# Altium schematic sheet USB Type C.SchDoc: USB Type C
size Tabloid; ApprovedBy: NA; CompanyName: Cospan Design LLC; DrawnBy: Dave McCoy; Engineer: Dave McCoy; DocumentNumber: 10; Revision: A; SheetNumber: 10; SheetTotal: 20; Client: Public; Project: Enigma; ProjectPrettyName: Enigma
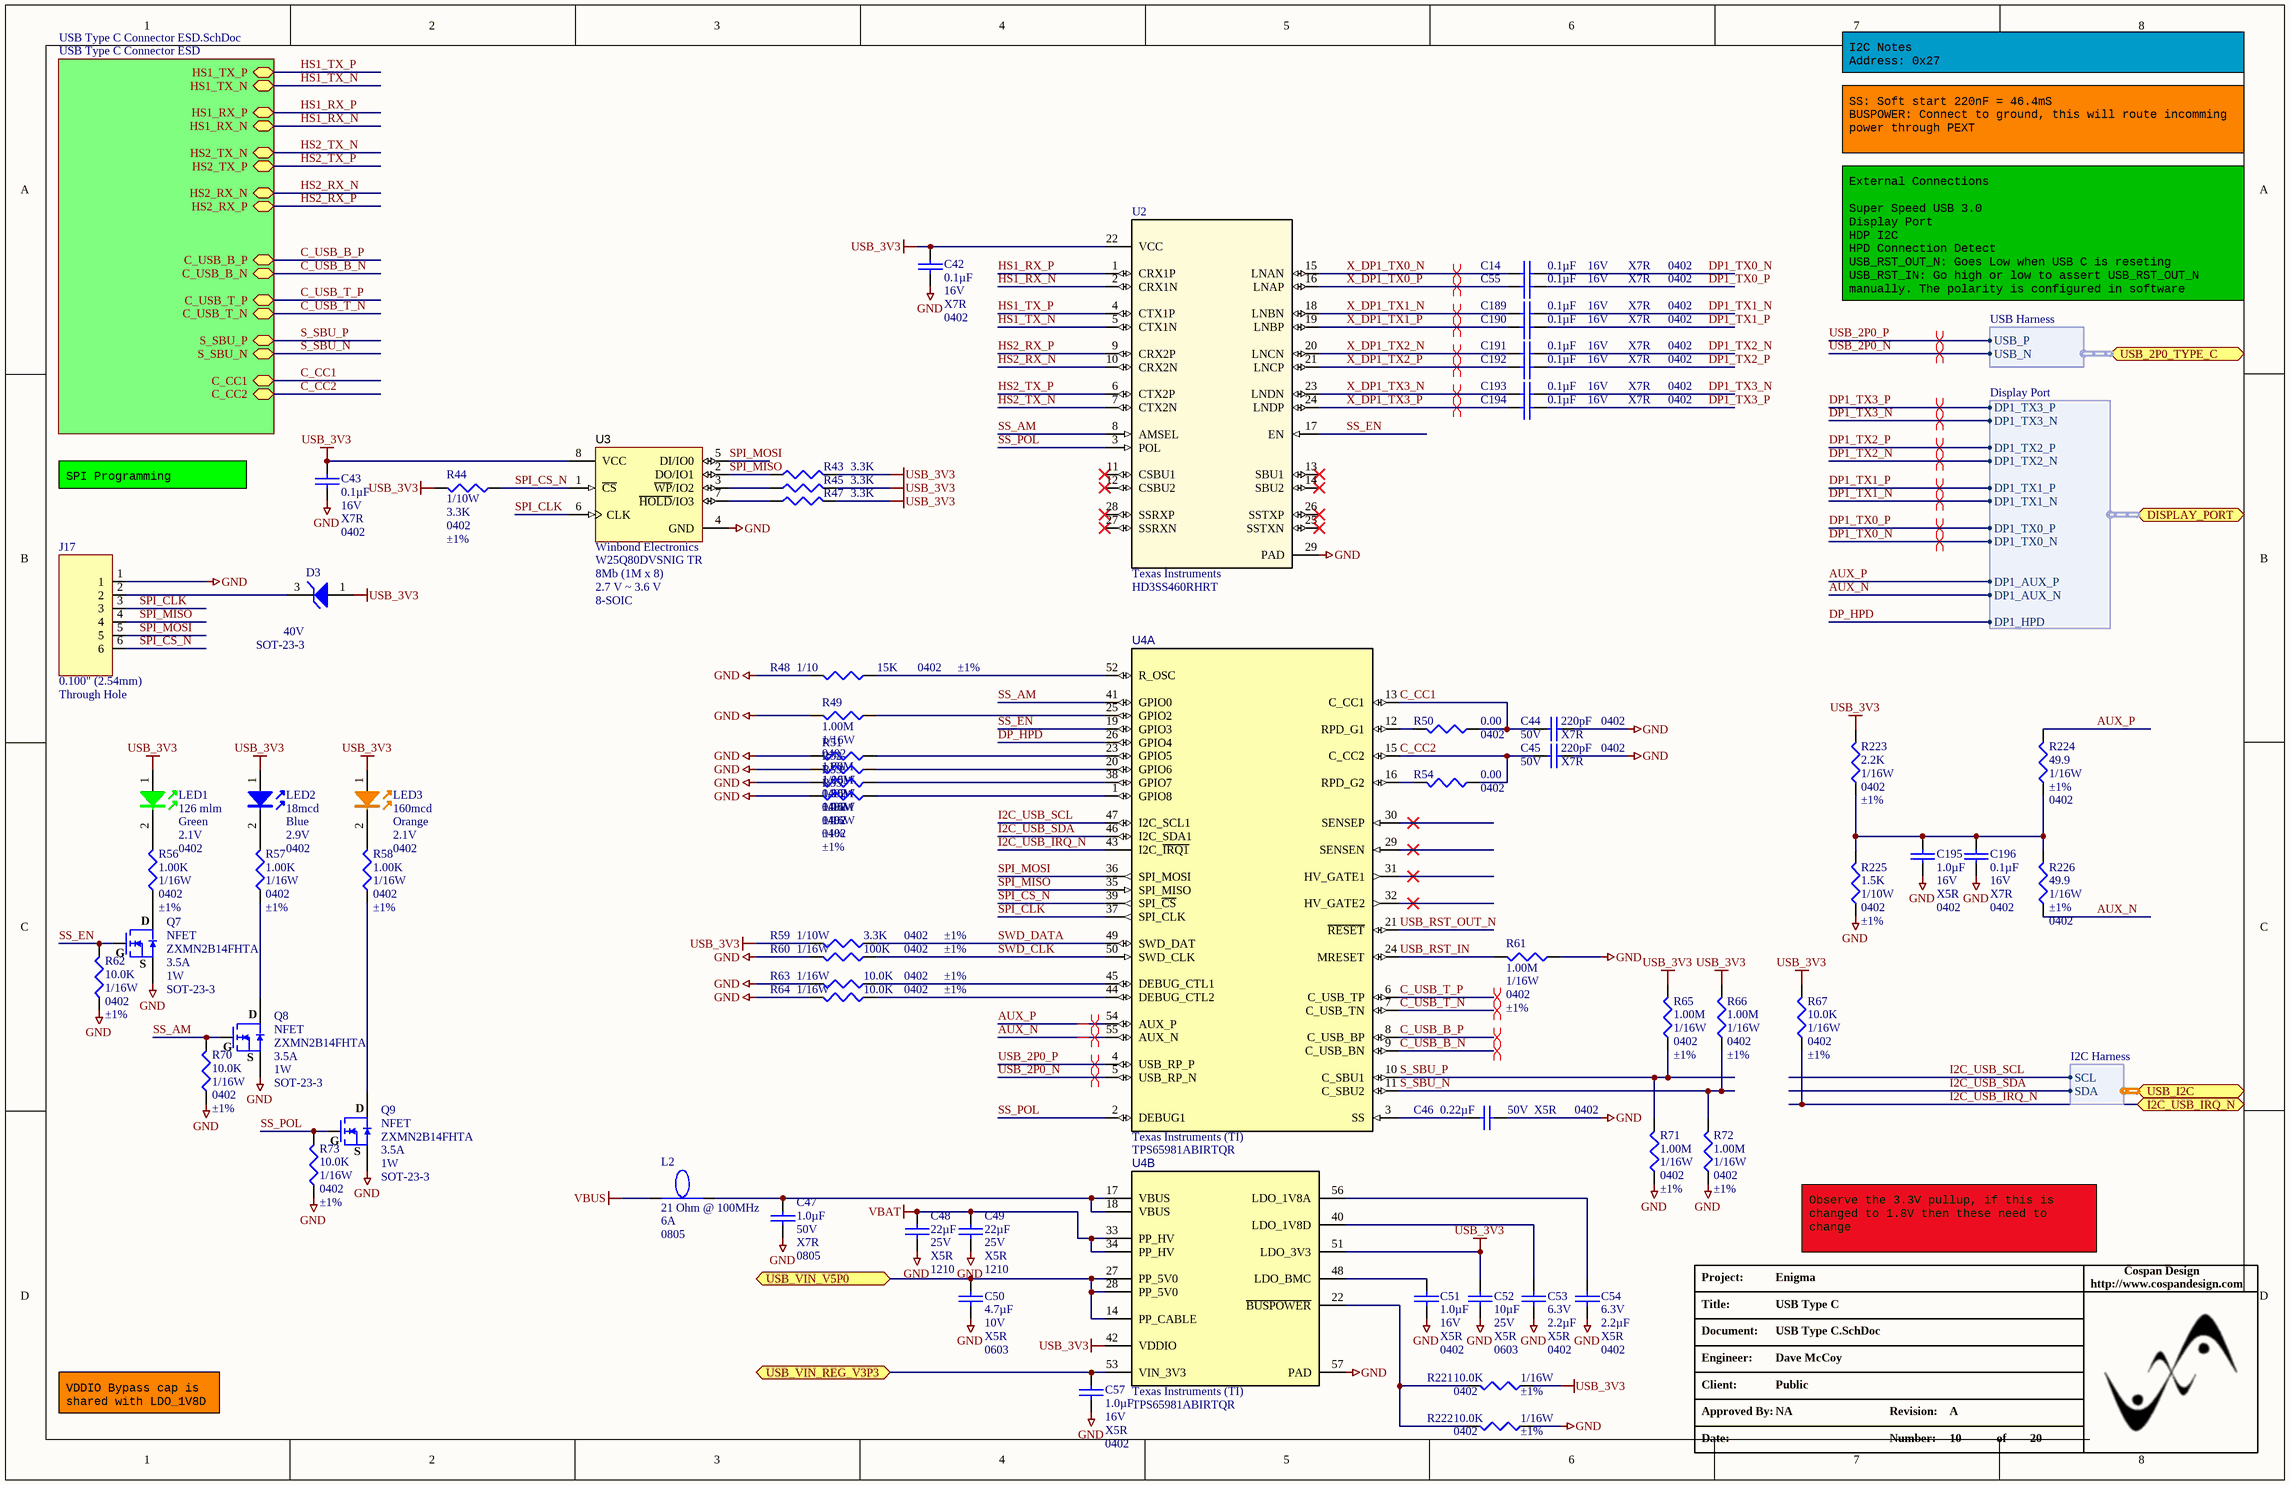
[diagram p0: USB Type C.SchDoc]

## Parts
C14  Capacitance: 0.1µF  Voltage - Rated: 16V  Temperature Coefficient: X7R  Package / Case: 0402  [C_0402]  (hidden comment: 0.1uF)
C42  Capacitance: 0.1µF  Voltage - Rated: 16V  Temperature Coefficient: X7R  Package / Case: 0402  [C_0402]  (hidden comment: 0.1uF)
C43  Capacitance: 0.1µF  Voltage - Rated: 16V  Temperature Coefficient: X7R  Package / Case: 0402  [C_0402]  (hidden comment: 0.1uF)
C44  Voltage - Rated: 50V  Temperature Coefficient: X7R  Package / Case: 0402  [C_0402]  (hidden comment: 220pF)
C45  Voltage - Rated: 50V  Temperature Coefficient: X7R  Package / Case: 0402  [C_0402]  (hidden comment: 220pF)
C46  Capacitance: 0.22µF  Voltage - Rated: 50V  Temperature Coefficient: X5R  Package / Case: 0402  [C_0402]  (hidden comment: C_0402_0.22UF_50V)
C47  Capacitance: 1.0µF  Voltage - Rated: 50V  Temperature Coefficient: X7R  Package / Case: 0805  [C_ERA-0805]  (hidden comment: 1.0uF)
C48  Voltage - Rated: 25V  Temperature Coefficient: X5R  Package / Case: 1210  [C_14-1210]  (hidden comment: 22µF)
C49  Voltage - Rated: 25V  Temperature Coefficient: X5R  Package / Case: 1210  [C_14-1210]  (hidden comment: 22µF)
C50  Voltage - Rated: 10V  Temperature Coefficient: X5R  Package / Case: 0603  [C_ERA-0603]  (hidden comment: 4.7µF)
C51  Capacitance: 1.0µF  Voltage - Rated: 16V  Temperature Coefficient: X5R  Package / Case: 0402  [C_ERA-0402]  (hidden comment: 1.0uF)
C52  Capacitance: 10µF  Voltage - Rated: 25V  Temperature Coefficient: X5R  Package / Case: 0603  [C_ERA-0603]  (hidden comment: C_0603_10µF)
C53  Voltage - Rated: 6.3V  Capacitance: 2.2µF  Temperature Coefficient: X5R  Package / Case: 0402  [C_0402]  (hidden comment: 2.2uF)
C54  Voltage - Rated: 6.3V  Capacitance: 2.2µF  Temperature Coefficient: X5R  Package / Case: 0402  [C_0402]  (hidden comment: 2.2uF)
C55  Capacitance: 0.1µF  Voltage - Rated: 16V  Temperature Coefficient: X7R  Package / Case: 0402  [C_0402]  (hidden comment: 0.1uF)
C57  Capacitance: 1.0µF  Voltage - Rated: 16V  Temperature Coefficient: X5R  Package / Case: 0402  [C_ERA-0402]  (hidden comment: 1.0uF)
C189  Capacitance: 0.1µF  Voltage - Rated: 16V  Temperature Coefficient: X7R  Package / Case: 0402  [C_0402]  (hidden comment: 0.1uF)
C190  Capacitance: 0.1µF  Voltage - Rated: 16V  Temperature Coefficient: X7R  Package / Case: 0402  [C_0402]  (hidden comment: 0.1uF)
C191  Capacitance: 0.1µF  Voltage - Rated: 16V  Temperature Coefficient: X7R  Package / Case: 0402  [C_0402]  (hidden comment: 0.1uF)
C192  Capacitance: 0.1µF  Voltage - Rated: 16V  Temperature Coefficient: X7R  Package / Case: 0402  [C_0402]  (hidden comment: 0.1uF)
C193  Capacitance: 0.1µF  Voltage - Rated: 16V  Temperature Coefficient: X7R  Package / Case: 0402  [C_0402]  (hidden comment: 0.1uF)
C194  Capacitance: 0.1µF  Voltage - Rated: 16V  Temperature Coefficient: X7R  Package / Case: 0402  [C_0402]  (hidden comment: 0.1uF)
C195  Capacitance: 1.0µF  Voltage - Rated: 16V  Temperature Coefficient: X5R  Package / Case: 0402  [C_ERA-0402]  (hidden comment: 1.0uF)
C196  Capacitance: 0.1µF  Voltage - Rated: 16V  Temperature Coefficient: X7R  Package / Case: 0402  [C_0402]  (hidden comment: 0.1uF)
D3  Voltage - Zener (Nom) (Vz): 40V  Supplier Device Package: SOT-23-3  [SOT23]  (hidden comment: BZX84C16-7-F)
J17  Pitch: 0.100" (2.54mm)  Mounting Type: Through Hole  [HDR_1X6]  (hidden comment: J_HDR1X6_THRHOLE_VERT)
L2  Impedance @ Frequency: 21 Ohm @ 100MHz  Current Rating: 6A  Package / Case: 0805  [C_ERA-0805]  (hidden comment: L_FB_21OHM_100MHZ)
LED1  Luminous Flux @ Current - Test: 126 mlm  Color: Green  Voltage - Forward (Vf) Typ: 2.1V  Package / Case: 0402  [DIOM1005X07L_GREEN]  (hidden comment: LED_GRN_0402)
LED2  Luminous Flux @ Current - Test: 18mcd  Color: Blue  Voltage - Forward (Vf) Typ: 2.9V  Package / Case: 0402  [DIOM1005X07L_BLUE]  (hidden comment: LED_BLUE_0402)
LED3  Millicandela Rating: 160mcd  Color: Orange  Voltage - Forward (Vf) Typ: 2.1V  Package / Case: 0402  [DIOM1005X07L_ORANGE]  (hidden comment: LED_ORN_0402)
Q7  NFET  Manufacturer Part Number: ZXMN2B14FHTA  Current - Continuous Drain (Id) @ 25° C: 3.5A  Power - Max: 1W  Package / Case: SOT-23-3  [SOT-23A]
Q8  NFET  Manufacturer Part Number: ZXMN2B14FHTA  Current - Continuous Drain (Id) @ 25° C: 3.5A  Power - Max: 1W  Package / Case: SOT-23-3  [SOT-23A]
Q9  NFET  Manufacturer Part Number: ZXMN2B14FHTA  Current - Continuous Drain (Id) @ 25° C: 3.5A  Power - Max: 1W  Package / Case: SOT-23-3  [SOT-23A]
R43  Resistance In Ohms: 3.3K  [R_0402]  (hidden comment: 3.3k Ohms)
R44  Power (Watts): 1/10W  Resistance In Ohms: 3.3K  Case: 0402  Tolerance: ±1%  [R_0402]  (hidden comment: 3.3k Ohms)
R45  Resistance In Ohms: 3.3K  [R_0402]  (hidden comment: 3.3k Ohms)
R47  Resistance In Ohms: 3.3K  [R_0402]  (hidden comment: 3.3k Ohms)
R48  Resistance In Ohms: 15K  Power (Watts): 1/10  Case: 0402  Tolerance: ±1%  [R_0402]  (hidden comment: R_0402_15.0K)
R49  Resistance In Ohms: 1.00M  Power (Watts): 1/16W  Case: 0402  Tolerance: ±1%  [R_0402]  (hidden comment: 1.0M Ohms)
R50  Resistance In Ohms: 0.00  Case: 0402  [R_0402]  (hidden comment: 0.0 Ohms)
R51  Resistance In Ohms: 1.00M  Power (Watts): 1/16W  Case: 0402  Tolerance: ±1%  [R_0402]  (hidden comment: 1.0M Ohms)
R52  Resistance In Ohms: 1.00M  Power (Watts): 1/16W  Case: 0402  Tolerance: ±1%  [R_0402]  (hidden comment: 1.0M Ohms)
R53  Resistance In Ohms: 1.00M  Power (Watts): 1/16W  Case: 0402  Tolerance: ±1%  [R_0402]  (hidden comment: 1.0M Ohms)
R54  Resistance In Ohms: 0.00  Case: 0402  [R_0402]  (hidden comment: 0.0 Ohms)
R55  Resistance In Ohms: 1.00M  Power (Watts): 1/16W  Case: 0402  Tolerance: ±1%  [R_0402]  (hidden comment: 1.0M Ohms)
R56  Resistance In Ohms: 1.00K  Power (Watts): 1/16W  Case: 0402  Tolerance: ±1%  [R_0402]  (hidden comment: 1.0k Ohms)
R57  Resistance In Ohms: 1.00K  Power (Watts): 1/16W  Case: 0402  Tolerance: ±1%  [R_0402]  (hidden comment: 1.0k Ohms)
R58  Resistance In Ohms: 1.00K  Power (Watts): 1/16W  Case: 0402  Tolerance: ±1%  [R_0402]  (hidden comment: 1.0k Ohms)
R59  Power (Watts): 1/10W  Resistance In Ohms: 3.3K  Case: 0402  Tolerance: ±1%  [R_0402]  (hidden comment: 3.3k Ohms)
R60  Resistance In Ohms: 100K  Power (Watts): 1/16W  Case: 0402  Tolerance: ±1%  [R_0402]  (hidden comment: R_0402_100K)
R61  Resistance In Ohms: 1.00M  Power (Watts): 1/16W  Case: 0402  Tolerance: ±1%  [R_0402]  (hidden comment: 1.0M Ohms)
R62  Resistance In Ohms: 10.0K  Power (Watts): 1/16W  Case: 0402  Tolerance: ±1%  [R_0402]  (hidden comment: R_0402_10.0K)
R63  Resistance In Ohms: 10.0K  Power (Watts): 1/16W  Case: 0402  Tolerance: ±1%  [R_0402]  (hidden comment: R_0402_10.0K)
R64  Resistance In Ohms: 10.0K  Power (Watts): 1/16W  Case: 0402  Tolerance: ±1%  [R_0402]  (hidden comment: R_0402_10.0K)
R65  Resistance In Ohms: 1.00M  Power (Watts): 1/16W  Case: 0402  Tolerance: ±1%  [R_0402]  (hidden comment: 1.0M Ohms)
R66  Resistance In Ohms: 1.00M  Power (Watts): 1/16W  Case: 0402  Tolerance: ±1%  [R_0402]  (hidden comment: 1.0M Ohms)
R67  Resistance In Ohms: 10.0K  Power (Watts): 1/16W  Case: 0402  Tolerance: ±1%  [R_0402]  (hidden comment: R_0402_10.0K)
R70  Resistance In Ohms: 10.0K  Power (Watts): 1/16W  Case: 0402  Tolerance: ±1%  [R_0402]  (hidden comment: R_0402_10.0K)
R71  Resistance In Ohms: 1.00M  Power (Watts): 1/16W  Case: 0402  Tolerance: ±1%  [R_0402]  (hidden comment: 1.0M Ohms)
R72  Resistance In Ohms: 1.00M  Power (Watts): 1/16W  Case: 0402  Tolerance: ±1%  [R_0402]  (hidden comment: 1.0M Ohms)
R73  Resistance In Ohms: 10.0K  Power (Watts): 1/16W  Case: 0402  Tolerance: ±1%  [R_0402]  (hidden comment: R_0402_10.0K)
R221  Resistance In Ohms: 10.0K  Power (Watts): 1/16W  Case: 0402  Tolerance: ±1%  [R_0402]  (hidden comment: R_0402_10.0K)
R222  Resistance In Ohms: 10.0K  Power (Watts): 1/16W  Case: 0402  Tolerance: ±1%  [R_0402]  (hidden comment: R_0402_10.0K)
R223  Resistance In Ohms: 2.2K  Power (Watts): 1/16W  Case: 0402  Tolerance: ±1%  [R_0402]  (hidden comment: R_0402_2.2K)
R224  Resistance (Ohms): 49.9  Power (Watts): 1/16W  Tolerance: ±1%  Package / Case: 0402  [R_0402]  (hidden comment: R_0402_49.9)
R225  Resistance In Ohms: 1.5K  Power (Watts): 1/10W  Case: 0402  Tolerance: ±1%  [R_0402]  (hidden comment: 1.5k Ohms)
R226  Resistance (Ohms): 49.9  Power (Watts): 1/16W  Tolerance: ±1%  Package / Case: 0402  [R_0402]  (hidden comment: R_0402_49.9)
U2  Manufacturer: Texas Instruments  Manufacturer Part Number: HD3SS460RHRT  [RHR0028A]  (hidden comment: U_HD3SS460RHRR)
U3  Manufacturer: Winbond Electronics  Manufacturer Part Number: W25Q80DVSNIG TR  Memory Size: 8Mb (1M x 8)  Voltage - Supply: 2.7 V ~ 3.6 V  Supplier Device Package: 8-SOIC  [SOIC-8 - TI]  (hidden comment: U_W25Q80DVSNIG)
U4  Manufacturer: Texas Instruments (TI)  Manufacturer Part Number: TPS65981ABIRTQR  [RWE0056B]  (parts A,B of 2)

## Sub-sheets
USB Type C Connector ESD.SchDoc = USB Type C Connector ESD: HS1_RX_P, HS1_RX_N, HS2_TX_N, HS2_TX_P, HS1_TX_P, HS1_TX_N, HS2_RX_N, HS2_RX_P, S_SBU_P, S_SBU_N, C_USB_B_P, C_USB_B_N, C_CC1, C_USB_T_P, C_USB_T_N, C_CC2

## Ports
DISPLAY_PORT (harness Display Port), I2C_USB_IRQ_N, USB_2P0_TYPE_C (harness USB Harness), USB_I2C (harness I2C Harness), USB_VIN_REG_V3P3, USB_VIN_V5P0

## Harnesses
Display Port: DP1_TX3_N, DP1_TX2_N, DP1_TX1_N, DP1_TX0_N, DP1_AUX_N, DP1_TX3_P, DP1_TX2_P, DP1_TX1_P, DP1_TX0_P, DP1_AUX_P, DP1_HPD
I2C Harness: SCL, SDA
USB Harness: USB_P, USB_N

## Nets
GND: C42.1 C43.1 C44.1 C45.1 C46.1 C47.1 C48.1 C49.1 C50.1 C51.1 C52.1 C53.1 C54.1 C57.1 C195.1 C196.1 J17.1 Q7.2(S) Q8.2(S) Q9.2(S) R48.1 R49.1 R51.1 R52.1 R53.1 R55.1 R60.1 R61.2 R62.2 R63.1 R64.1 R70.2 R71.2 R72.2 R73.2 R222.2 R225.2 U2.29(PAD) U3.4(GND) U4.57(PAD)
USB_3V3: C42.2 C43.2 C52.2 D3.1(A) LED1.1 LED2.1 LED3.1 R43.1 R44.1 R45.1 R47.1 R59.1 R65.1 R66.1 R67.1 R221.2 R223.1 U2.22(VCC) U3.8(VCC) U4.42(VDDIO) U4.51(LDO_3V3)
VBAT: C48.2 C49.2 U4.33(PP_HV) U4.34(PP_HV)
VBUS: L2.1
AUX_N: R226.2 U4.55(AUX_N) ; port DISPLAY_PORT.DP1_AUX_N
AUX_P: R224.1 U4.54(AUX_P) ; port DISPLAY_PORT.DP1_AUX_P
C_CC1: C44.2 R50.2 U4.13(C_CC1) ; sheet USB Type C Connector ESD.SchDoc/C_CC1
C_CC2: C45.2 R54.2 U4.15(C_CC2) ; sheet USB Type C Connector ESD.SchDoc/C_CC2
C_USB_B_N: U4.9(C_USB_BN) ; sheet USB Type C Connector ESD.SchDoc/C_USB_B_N
C_USB_B_P: U4.8(C_USB_BP) ; sheet USB Type C Connector ESD.SchDoc/C_USB_B_P
C_USB_T_N: U4.7(C_USB_TN) ; sheet USB Type C Connector ESD.SchDoc/C_USB_T_N
C_USB_T_P: U4.6(C_USB_TP) ; sheet USB Type C Connector ESD.SchDoc/C_USB_T_P
DP1_TX0_N: C14.1 ; port DISPLAY_PORT.DP1_TX0_N
DP1_TX0_P: C55.1 ; port DISPLAY_PORT.DP1_TX0_P
DP1_TX1_N: C189.1 ; port DISPLAY_PORT.DP1_TX1_N
DP1_TX1_P: C190.1 ; port DISPLAY_PORT.DP1_TX1_P
DP1_TX2_N: C191.1 ; port DISPLAY_PORT.DP1_TX2_N
DP1_TX2_P: C192.1 ; port DISPLAY_PORT.DP1_TX2_P
DP1_TX3_N: C193.1 ; port DISPLAY_PORT.DP1_TX3_N
DP1_TX3_P: C194.1 ; port DISPLAY_PORT.DP1_TX3_P
DP_HPD: U4.26(GPIO4) ; port DISPLAY_PORT.DP1_HPD
HS1_RX_N: U2.2(CRX1N) ; sheet USB Type C Connector ESD.SchDoc/HS1_RX_N
HS1_RX_P: U2.1(CRX1P) ; sheet USB Type C Connector ESD.SchDoc/HS1_RX_P
HS1_TX_N: U2.5(CTX1N) ; sheet USB Type C Connector ESD.SchDoc/HS1_TX_N
HS1_TX_P: U2.4(CTX1P) ; sheet USB Type C Connector ESD.SchDoc/HS1_TX_P
HS2_RX_N: U2.10(CRX2N) ; sheet USB Type C Connector ESD.SchDoc/HS2_RX_N
HS2_RX_P: U2.9(CRX2P) ; sheet USB Type C Connector ESD.SchDoc/HS2_RX_P
HS2_TX_N: U2.7(CTX2N) ; sheet USB Type C Connector ESD.SchDoc/HS2_TX_N
HS2_TX_P: U2.6(CTX2P) ; sheet USB Type C Connector ESD.SchDoc/HS2_TX_P
I2C_USB_IRQ_N: R67.2 U4.43(I2C_~{IRQ1}) ; port I2C_USB_IRQ_N
I2C_USB_SCL: U4.47(I2C_SCL1) ; port USB_I2C.SCL
I2C_USB_SDA: U4.46(I2C_SDA1) ; port USB_I2C.SDA
S_SBU_N: R66.2 R72.1 U4.11(C_SBU2) ; sheet USB Type C Connector ESD.SchDoc/S_SBU_N
S_SBU_P: R65.2 R71.1 U4.10(C_SBU1) ; sheet USB Type C Connector ESD.SchDoc/S_SBU_P
SPI_CLK: J17.3 U3.6(CLK) U4.37(SPI_CLK)
SPI_CS_N: J17.6 R44.2 U3.1(~{CS}) U4.39(SPI_~{CS})
SPI_MISO: J17.4 R43.2 U3.2(DO/IO1) U4.35(SPI_MISO)
SPI_MOSI: J17.5 U3.5(DI/IO0) U4.36(SPI_MOSI)
SS_AM: Q8.1(G) R70.1 U2.8(AMSEL) U4.41(GPIO0)
SS_EN: Q7.1(G) R62.1 U2.17(EN) U4.19(GPIO3)
SS_POL: Q9.1(G) R73.1 U2.3(POL) U4.2(DEBUG1)
SWD_CLK: R60.2 U4.50(SWD_CLK)
SWD_DATA: R59.2 U4.49(SWD_DAT)
USB_2P0_N: U4.5(USB_RP_N) ; port USB_2P0_TYPE_C.USB_N
USB_2P0_P: U4.4(USB_RP_P) ; port USB_2P0_TYPE_C.USB_P
USB_RST_IN: R61.1 U4.24(MRESET)
USB_RST_OUT_N: U4.21(~{RESET})
USB_VIN_REG_V3P3: C57.2 U4.53(VIN_3V3) ; port USB_VIN_REG_V3P3
USB_VIN_V5P0: C50.2 U4.14(PP_CABLE) U4.27(PP_5V0) U4.28(PP_5V0) ; port USB_VIN_V5P0
X_DP1_TX0_N: C14.2 U2.15(LNAN)
X_DP1_TX0_P: C55.2 U2.16(LNAP)
X_DP1_TX1_N: C189.2 U2.18(LNBN)
X_DP1_TX1_P: C190.2 U2.19(LNBP)
X_DP1_TX2_N: C191.2 U2.20(LNCN)
X_DP1_TX2_P: C192.2 U2.21(LNCP)
X_DP1_TX3_N: C193.2 U2.23(LNDN)
X_DP1_TX3_P: C194.2 U2.24(LNDP)
NetC46_2: C46.2 U4.3(SS)
NetC47_2: C47.2 L2.2 U4.17(VBUS) U4.18(VBUS)
NetC51_2: C51.2 U4.48(LDO_BMC)
NetC53_2: C53.2 U4.40(LDO_1V8D)
NetC54_2: C54.2 U4.56(LDO_1V8A)
NetC195_2: C195.2 C196.2 R223.2 R224.2 R225.1 R226.1
NetD3_3: D3.3(K) J17.2
NetLED1_2: LED1.2 R56.1
NetLED2_2: LED2.2 R57.1
NetLED3_2: LED3.2 R58.1
NetQ7_3: Q7.3(D) R56.2
NetQ8_3: Q8.3(D) R57.2
NetQ9_3: Q9.3(D) R58.2
NetR45_2: R45.2 U3.3(~{WP}/IO2)
NetR47_2: R47.2 U3.7(~{HOLD}/IO3)
NetR48_2: R48.2 U4.52(R_OSC)
NetR49_2: R49.2 U4.25(GPIO2)
NetR50_1: R50.1 U4.12(RPD_G1)
NetR51_2: R51.2 U4.23(GPIO5)
NetR52_2: R52.2 U4.20(GPIO6)
NetR53_2: R53.2 U4.38(GPIO7)
NetR54_1: R54.1 U4.16(RPD_G2)
NetR55_2: R55.2 U4.1(GPIO8)
NetR63_2: R63.2 U4.45(DEBUG_CTL1)
NetR64_2: R64.2 U4.44(DEBUG_CTL2)
NetR221_1: R221.1 R222.1 U4.22(~{BUSPOWER})

Not connected (* = marked no-connect by the designer): U2 11(CSBU1)* 12(CSBU2)* 13(SBU1)* 14(SBU2)* 25(SSTXN)* 26(SSTXP)* 27(SSRXN)* 28(SSRXP)*; U4 29(SENSEN)* 30(SENSEP)* 31(HV_GATE1)* 32(HV_GATE2)*

## Layout directives
differential pair: AUX_N, AUX_P, C_USB_B_N, C_USB_B_P, C_USB_T_N, C_USB_T_P, DP1_TX0_N, DP1_TX0_P, DP1_TX1_N, DP1_TX1_P, DP1_TX2_N, DP1_TX2_P, DP1_TX3_N, DP1_TX3_P, USB_2P0_N, USB_2P0_P, X_DP1_TX0_N, X_DP1_TX0_P, X_DP1_TX1_N, X_DP1_TX1_P, X_DP1_TX2_N, X_DP1_TX2_P, X_DP1_TX3_N, X_DP1_TX3_P

## Notes on the sheet
- I2C Notes
  Address: 0x27
- SS: Soft start 220nF = 46.4mS
  BUSPOWER: Connect to ground, this will route incomming power through PEXT
- External Connections
  Super Speed USB 3.0
  Display Port
  HDP I2C
  HPD Connection Detect
  USB_RST_OUT_N: Goes Low when USB C is reseting
  USB_RST_IN: Go high or low to assert USB_RST_OUT_N manually. The polarity is configured in software
- SPI Programming Connector
- Observe the 3.3V pullup, if this is changed to 1.8V then these need to change
- VDDIO Bypass cap is shared with LDO_1V8D
- Project:
- http://www.cospandesign.com
- Cospan Design
- Document:
- Engineer:
- Title:
- Client:
- Approved By:
- Revision:
- Date:
- Number:
- of

## Library data of the parts
C14 C42 C43 C55 C189-C194 C196 = C_0402_0.1UF_16V: CAP CER .10UF 16V X7R 0402; Manufacturer: Murata Electronics North America; Manufacturer Part Number: GRM155R71C104KA88J; Tolerance: ±10%; Description: CAP CER 0.1UF 16V X7R 0402; Supplier 1: Digi-Key; RoHS: RoHS Compliant; Category: Capacitors; Stock 1: 18103134; Pricing 1: 1=0.1, 10=0.014, 100=0.0062, 500=0.00442, 1000=0.00348, 2500=0.00316, 5000=0.00291 (USD); Packaging: Cut Tape (CT); Part Status: Active; Operating Temperature: -55°C ~ 125°C; Features: -; Ratings: -; Applications: General Purpose; Mounting Type: Surface Mount, MLCC; Size / Dimension: 0.039" L x 0.020" W (1.00mm x 0.50mm); Height - Seated (Max): -; Thickness (Max): 0.022" (0.55mm); Lead Spacing: -; ComponentLink1URL: http://www.murata.com/~/media/webrenewal/support/library/catalog/products/capacitor/mlcc/c02e.ashx?la=en-us; ComponentLink1Description: http://www.murata.com/~/media/webrenewal/support/library/catalog/products/capacitor/mlcc/c02e.ashx?la=en-us; Supplier Part Number 1: 490-6328-1-ND
C44 C45 = C_0402_220PF_50V: CAP CER 220PF 50V 10% X7R 0402; Manufacturer: Murata Electronics North America; Manufacturer Part Number: GRM155R71H221KA01D; Supplier 1: Digi-Key; Supplier Part Number 1: 490-1298-1-ND; RoHS: RoHS Compliant; Category: Capacitors; Stock 1: 239876; Pricing: 10=0.034, 50=0.0272, 100=0.0204, 250=0.01476, 500=0.0109, 1000=0.00738 (USD); Tolerance: ±10%; Mounting Type: Surface Mount, MLCC; Operating Temperature: -55°C ~ 125°C; Applications: General Purpose; Ratings: -; Size / Dimension: 0.039" L x 0.020" W (1.00mm x 0.50mm); Height: -; Thickness: 0.022" (0.55mm); Lead Spacing: -; Features: -; Packaging: Cut Tape (CT); Lead Style: -; ComponentLink1URL: http://search.murata.co.jp/Ceramy/image/img/PDF/ENG/GRM155R71H221KA01.pdf; ComponentLink1Description: http://search.murata.co.jp/Ceramy/image/img/PDF/ENG/GRM155R71H221KA01.pdf; Capacitance: 220pF
C46 = C_0402_0.22UF_50V: CAP CER 0.22UF 50V X5R 0402; Manufacturer: Taiyo Yuden; Manufacturer Part Number: UMK105BJ224KV-F; Tolerance: ±10%; Supplier 1: Digi-Key; RoHS: RoHS Compliant; Category: Capacitors; Stock 1: 141424; Pricing 1: 1=0.35, 10=0.263, 50=0.1532, 100=0.1225, 250=0.08752, 500=0.0595, 1000=0.04813, 5000=0.03763 (USD); Packaging: Digi-Reel®; Mounting Type: Surface Mount, MLCC; Operating Temperature: -55°C ~ 85°C; Applications: General Purpose; Ratings: -; Size / Dimension: 0.039" L x 0.020" W (1.00mm x 0.50mm); Height - Seated (Max): -; Thickness (Max): 0.022" (0.55mm); Lead Spacing: -; Features: -; Lead Style: -; ComponentLink1URL: http://ds.yuden.co.jp/TYCOMPAS/ut/detail.do?productNo=UMK105BJ224KV-F&fileName=UMK105BJ224KV-F_SS&mode=specSheetDownload; ComponentLink1Description: http://ds.yuden.co.jp/TYCOMPAS/ut/detail.do?productNo=UMK105BJ224KV-F&fileName=UMK105BJ224KV-F_SS&mode=specSheetDownload; Supplier Part Number 1: 587-3500-6-ND
C47 = C_0805_1.0uF_50V: CAP CER 1UF 50V X7R 0805; Manufacturer: Murata Electronics North America; Manufacturer Part Number: GRM21BR71H105KA12L; Tolerance: ±10%; Supplier 1: Digi-Key; RoHS: RoHS Compliant; Category: Capacitors; Stock 1: 322160; Pricing 1: 10=0.529, 100=0.3127, 500=0.18038, 1000=0.12506 (USD); Mounting Type: Surface Mount, MLCC; Operating Temperature: -55°C ~ 125°C; Features: -; Applications: General Purpose; Ratings: -; Size / Dimension: 0.079" L x 0.049" W (2.00mm x 1.25mm); Lead Spacing: -; Thickness: 1.25mm; Packaging: Cut Tape (CT); Lead Style: -; ComponentLink1URL: http://search.murata.co.jp/Ceramy/image/img/PDF/ENG/GRM21BR71H105KA12.pdf; ComponentLink1Description: http://search.murata.co.jp/Ceramy/image/img/PDF/ENG/GRM21BR71H105KA12.pdf; Supplier Part Number 1: 490-4736-1-ND
C48 C49 = C_1210_22µF: CAP CER 22UF 25V 20% X5R 1210; Manufacturer: Taiyo Yuden; Manufacturer Part Number: TMK325BJ226MM-T; Supplier 1: Digi-Key; Supplier Part Number 1: 587-2086-1-ND; RoHS: RoHS Compliant; Category: Capacitors; Stock 1: 53533; Pricing: 1=0.86, 10=0.731, 50=0.5382, 100=0.4278, 250=0.3588 (USD); Tolerance: ±20%; Mounting Type: Surface Mount, MLCC; Operating Temperature: -55°C ~ 85°C; Applications: General Purpose; Ratings: -; Size / Dimension: 0.126" L x 0.098" W (3.20mm x 2.50mm); Height - Seated (Max): -; Thickness (Max): 0.106" (2.70mm); Lead Spacing: -; Features: -; Packaging: Cut Tape (CT); Lead Style: -; ComponentLink1URL: http://www.yuden.co.jp/productdata/catalog/en/mlcc01_e.pdf; ComponentLink1Description: http://www.yuden.co.jp/productdata/catalog/en/mlcc01_e.pdf; Capacitance: 22µF
C50 = C_0603_4.7uF_10V: CAP CER 4.7UF 10V X5R 0603; Manufacturer: Murata Electronics North America; Manufacturer Part Number: GRM188R61A475KE15D; Tolerance: ±10%; Supplier 1: Digi-Key; RoHS: RoHS Compliant; Category: Capacitors; Stock 1: 163304; Pricing 1: 1=0.15, 10=0.105, 100=0.0495, 500=0.03472, 1000=0.02875 (USD); Mounting Type: Surface Mount, MLCC; Operating Temperature: -55°C ~ 85°C; Features: Derating Recommended; Applications: General Purpose; Ratings: -; Size / Dimension: 0.063" L x 0.032" W (1.60mm x 0.80mm); Lead Spacing: -; Packaging: Cut Tape (CT); Lead Style: -; ComponentLink1URL: http://search.murata.co.jp/Ceramy/image/img/A01X/G101/ENG/GRM188R61A475KE15-01.pdf; ComponentLink1Description: http://search.murata.co.jp/Ceramy/image/img/A01X/G101/ENG/GRM188R61A475KE15-01.pdf; Supplier Part Number 1: 490-10477-1-ND; Capacitance: 4.7µF; Part Status: Active; Height - Seated (Max): -; Thickness (Max): 0.039" (1.00mm)
C51 C57 C195 = C_0402_1.0UF_16V: CAP CER 1.0UF 16V X5R 0402; Manufacturer: Taiyo Yuden; Manufacturer Part Number: EMK105BJ105KV-F; Tolerance: ±10%; Description: CAP CER 1UF 16V X5R 0402; Supplier 1: Digi-Key; RoHS: RoHS Compliant; Category: Capacitors; Stock 1: 489909; Pricing 1: 1=0.1, 10=0.063, 100=0.028, 500=0.01998, 1000=0.0157, 2500=0.01427, 5000=0.01313 (USD); Packaging: Cut Tape (CT); Part Status: Active; Operating Temperature: -55°C ~ 85°C; Features: -; Ratings: -; Applications: General Purpose; Mounting Type: Surface Mount, MLCC; Size / Dimension: 0.039" L x 0.020" W (1.00mm x 0.50mm); Height - Seated (Max): -; Thickness (Max): 0.022" (0.55mm); Lead Spacing: -; Lead Style: -; ComponentLink1URL: http://ds.yuden.co.jp/TYCOMPAS/ut/detail.do?productNo=EMK105BJ105KV-F&fileName=EMK105BJ105KV-F_SS&mode=specSheetDownload; ComponentLink1Description: http://ds.yuden.co.jp/TYCOMPAS/ut/detail.do?productNo=EMK105BJ105KV-F&fileName=EMK105BJ105KV-F_SS&mode=specSheetDownload; Supplier Part Number 1: 587-2477-1-ND
C52 = C_0603_10µF: CAP CER 10UF 16V X5R 0603; Manufacturer: Murata Electronics North America; Manufacturer Part Number: GRM188R61C106MA73D; Tolerance: ±20%; Supplier 1: Digi-Key; RoHS: RoHS Compliant; Category: Capacitors; Stock 1: 450536; Pricing 1: 1=0.35, 10=0.303, 50=0.184, 100=0.1516, 250=0.12124, 500=0.11042, 1000=0.09959 (USD); Packaging: Cut Tape (CT); Mounting Type: Surface Mount, MLCC; Operating Temperature: -55°C ~ 85°C; Applications: General Purpose; Ratings: -; Size / Dimension: 0.063" L x 0.031" W (1.60mm x 0.80mm); Height - Seated (Max): -; Thickness (Max): 0.031" (0.80mm); Lead Spacing: -; Features: -; Lead Style: -; ComponentLink1URL: http://www.murata.com/~/media/webrenewal/support/library/catalog/products/capacitor/mlcc/c02e.pdf; ComponentLink1Description: http://www.murata.com/~/media/webrenewal/support/library/catalog/products/capacitor/mlcc/c02e.pdf; Supplier Part Number 1: 490-7201-1-ND
C53 C54 = C_0402_2.2UF: CAP CER 2.2UF 6.3V X5R 0402; Manufacturer: TDK Corporation; Manufacturer Part Number: C1005X5R0J225M; Tolerance: ±20%; Supplier 1: Digi-Key; Supplier Part Number 1: 445-4999-1-ND; RoHS: RoHS Compliant; Category: Capacitors; Stock 1: 511888; Pricing: 1=0.44, 10=0.33, 100=0.154, 250=0.11, 500=0.0748, 1000=0.0605 (USD); Mounting Type: Surface Mount, MLCC; Operating Temperature: -55°C ~ 85°C; Applications: General Purpose; Ratings: -; Size / Dimension: 0.039" L x 0.020" W (1.00mm x 0.50mm); Height: -; Thickness: 0.022" (0.55mm); Lead Spacing: -; Features: -; Packaging: Cut Tape (CT); Lead Style: -; ComponentLink1URL: http://www.tdk.co.jp/tefe02/e412_c.pdf; ComponentLink1Description: http://www.tdk.co.jp/tefe02/e412_c.pdf
D3 = D_SCHOTTKY_40V_SOT23: DIODE SCHOTTKY 40V 500MA SOT23-3; Manufacturer: Diodes Incorporated; Manufacturer Part Number: BAT400D-7-F; Voltage - Forward (Vf) (Max) @ If: 550mV @ 500mA; Speed: Fast Recovery =< 500ns, > 200mA (Io); Current - Reverse Leakage @ Vr: 50µA @ 30V; Capacitance @ Vr, F: 125pF @ 0V, 1MHz; Supplier 1: Digi-Key; RoHS: RoHS Compliant; Category: Discrete Semiconductor Products; Stock 1: 73267; Pricing 1: 1=0.44, 10=0.374, 100=0.2792, 500=0.21934, 1000=0.1695 (USD); Packaging: Cut Tape (CT); Diode Type: Schottky; Current - Average Rectified (Io): 500mA; Mounting Type: Surface Mount; Package / Case: TO-236-3, SC-59, SOT-23-3; Operating Temperature - Junction: -40°C ~ 125°C; ComponentLink1URL: https://www.diodes.com/assets/Datasheets/ds30182.pdf; ComponentLink1Description: https://www.diodes.com/assets/Datasheets/ds30182.pdf; Supplier Part Number 1: BAT400D-FDICT-ND; Part Status: Active
J17 = J_HDR1X6_THRHOLE_VERT: CONN HEADER .100" 12POS TIN PCB; Manufacturer: Samtec; Manufacturer Part Number: TSW-106-07-T-S; Connector Type: Unshrouded; Number of Positions: 6; Number of Positions Loaded: All; Supplier 1: Samtec; Supplier Part Number 1: TSW-106-07-T-S; RoHS: RoHS Compliant; Category: Connectors, Interconnects; Stock 1: 0; Number of Rows: 1; Row Spacing: -; Height Stacking (Mating): -; Height Above Board: 0.100" (2.54mm); Contact Mating Length: 0.166" (4.22mm); Termination: Solder; Contact Finish: Tin; Contact Finish Thickness: 200µin (5.08µm); Features: -; Color: Black; Packaging: Bulk; ComponentLink1URL: http://www.samtec.com/ftppub/cpdf/TX-MKT1.PDF; ComponentLink1Description: http://www.samtec.com/ftppub/cpdf/TX-MKT1.PDF; Molding Height Above Board: 0.100" (2.54mm); ComponentLink2URL: http://www.samtec.com/ftppub/pdf/TD.PDF; ComponentLink2Description: http://www.samtec.com/ftppub/pdf/TD.PDF; Pricing: 1=0.201
L2 = L_FB_21OHM_100MHZ: FERRITE BEAD 21 OHM 0805 1LN; Manufacturer: Taiyo Yuden; Manufacturer Part Number: FBMJ2125HM210NT; Filter Type: Power Line; DC Resistance (DCR) (Max): 4 mOhm; Supplier 1: Digi-Key; Stock 1: 26823; Pricing 1: 1=0.12, 10=0.099, 25=0.0772, 50=0.0638, 100=0.055, 250=0.044, 500=0.0396, 1000=0.033 (USD); Packaging: Cut Tape (CT); ComponentLink1URL: http://ds.yuden.co.jp/TYCOMPAS/ut/detail.do?productNo=FBMJ2125HM210NT&fileName=FBMJ2125HM210NT_SS&mode=specSheetDownload; ComponentLink1Description: http://ds.yuden.co.jp/TYCOMPAS/ut/detail.do?productNo=FBMJ2125HM210NT&fileName=FBMJ2125HM210NT_SS&mode=specSheetDownload; Supplier Part Number 1: 587-1765-1-ND; RoHS: RoHS Compliant; Category: Filters; Part Status: Active; Current Rating (Max): 6A; Ratings: -; Operating Temperature: -40°C ~ 125°C; Mounting Type: Surface Mount; Height (Max): 0.041" (1.05mm); Size / Dimension: 0.079" L x 0.049" W (2.00mm x 1.25mm)
LED1 = LED_GRN_0402: LED 1X0.5MM 570NM GN WTR CLR SMD; Manufacturer: Kingbright Corp; Manufacturer Part Number: APHHS1005CGCK; Current - Test: 20mA; Wavelength - Peak: 574nm; Millicandela Rating: 40mcd; Lens Type: Clear; Lens Style/Size: Rectangle, 0.8mm x 0.5mm; Viewing Angle: 120°; Supplier 1: Digi-Key; Supplier Part Number 1: 754-1101-1-ND; RoHS: RoHS Compliant; Category: Optoelectronics; Stock 1: 3400; Pricing: 1=0.24, 10=0.176, 25=0.1412, 100=0.1293, 250=0.11752, 500=0.10576, 1000=0.094 (USD); Wavelength - Dominant: 570nm; Mounting Type: Surface Mount; Packaging: Cut Tape (CT); Size / Dimension: *; Height: *; ComponentLink1URL: http://www.us.kingbright.com/images/catalog/SPEC/APHHS1005CGCK.pdf; ComponentLink1Description: http://www.us.kingbright.com/images/catalog/SPEC/APHHS1005CGCK.pdf
LED2 = LED_BLUE_0402: LED 1X0.5MM 470NM BL WTR CLR SMD; Manufacturer: Panasonic Electronic Components - Semiconductor Products; Manufacturer Part Number: LNJ947W8CRA; Current - Test: 5mA; Wavelength - Dominant: 472nm; Wavelength - Peak: 465nm; Lens Style/Size: Rectangle with Flat Top, 0.7mm x 0.5mm; RoHS: RoHS Compliant; Category: Optoelectronics; Millicandela Rating: 18mcd; Viewing Angle: -; Lens Type: -; Size / Dimension: 1.00mm L x 0.50mm W; Height: 0.20mm; Mounting Type: Surface Mount; Supplier 1: Digi-Key; Supplier Part Number 1: LNJ947W8CRACT-ND; Stock 1: 25660; Pricing: 1=0.52, 25=0.342, 100=0.2808, 250=0.234, 500=0.1944, 1000=0.144 (USD); Packaging: Cut Tape (CT); ComponentLink1URL: http://industrial.panasonic.com/www-cgi/jvcr13pz.cgi?E+SC+4+ATA7003+LNJ947W8CRA+8+WW; ComponentLink1Description: http://industrial.panasonic.com/www-cgi/jvcr13pz.cgi?E+SC+4+ATA7003+LNJ947W8CRA+8+WW
LED3 = LED_ORN_0402: LED 1X0.5MM 601NM ORN WTRCLR SMD; Manufacturer: Kingbright Corp; Manufacturer Part Number: APHHS1005SECK; Luminous Flux @ Current - Test: 503 mlm; Current - Test: 20mA; Wavelength - Peak: 610nm; Lens Type: Clear; Lens Style/Size: Rectangle, 0.8mm x 0.5mm; Viewing Angle: 120°; Supplier 1: Digi-Key; RoHS: RoHS Compliant; Category: Optoelectronics; Stock 1: 12357; Pricing 1: 1=0.3, 10=0.221, 25=0.1772, 100=0.1623, 250=0.14752, 500=0.13276, 1000=0.118 (USD); Wavelength - Dominant: 601nm; Mounting Type: Surface Mount; Packaging: Cut Tape (CT); ComponentLink1URL: http://www.us.kingbright.com/images/catalog/SPEC/APHHS1005SECK.pdf; ComponentLink1Description: http://www.us.kingbright.com/images/catalog/SPEC/APHHS1005SECK.pdf; Supplier Part Number 1: 754-1103-1-ND
Q7-Q9 = Q_NFET_3.50A_SOT23: MOSFET N-CH 20V 3.5A SOT23-3; Manufacturer: Diodes Incorporated; FET Type: N-Channel; Rds On (Max) @ Id, Vgs: 55 mOhm @ 3.5A, 4.5V; Vgs(th) (Max) @ Id: 1V @ 250µA; Current - Continuous Drain (Id) @ 25°C: 3.5A (Ta); Drive Voltage (Max Rds On,  Min Rds On): 1.8V, 4.5V; Gate Charge (Qg) (Max) @ Vgs: 11nC @ 4.5V; Input Capacitance (Ciss) (Max) @ Vds: 872pF @ 10V; Vgs (Max): ±8V; Power Dissipation (Max): 1W (Ta); Supplier 1: Digi-Key; Supplier Part Number 1: ZXMN2B14FHCT-ND; RoHS: RoHS Compliant; Category: Discrete Semiconductor Products; Stock 1: 1379; FET Feature: -; Drain to Source Voltage (Vdss): 20V; Mounting Type: Surface Mount; Supplier Device Package: SOT-23-3; Packaging: Cut Tape (CT); ComponentLink1URL: http://www.diodes.com/_files/datasheets/ZXMN2B14FH.pdf; ComponentLink1Description: http://www.diodes.com/_files/datasheets/ZXMN2B14FH.pdf; Pricing 1: 1=0.78, 10=0.683, 100=0.5238, 500=0.41406, 1000=0.33125 (USD); Part Status: Active; Technology: MOSFET (Metal Oxide); Operating Temperature: -55°C ~ 150°C (TJ)
R43-R45 R47 R59 = R_0402_3.3K: RES 3.30K OHM 1/10W 1% 0402 SM; Manufacturer: Panasonic - ECG; Manufacturer Part Number: ERJ-2RKF3301X; Temperature Coefficient: ±100ppm/°C; Supplier 1: Digi-Key; Supplier Part Number 1: P3.30KLCT-ND; RoHS: RoHS Compliant; Category: Resistors; Stock 1: 246274; Pricing: 1=0.06, 50=0.0242, 100=0.0184, 250=0.01364, 500=0.01008, 1000=0.00672, 5000=0.00473 (USD); Composition: Thick Film; Features: -; Size / Dimension: 0.039" L x 0.020" W (1.00mm x 0.50mm); Height: 0.014" (0.35mm); Number of Terminations: 2; Packaging: Cut Tape (CT); Package / Case: 0402 (1005 Metric); ComponentLink1URL: http://industrial.panasonic.com/www-cgi/jvcr13pz.cgi?E+PZ+3+AOA0002+ERJ2RKF3301X+7+WW; ComponentLink1Description: http://industrial.panasonic.com/www-cgi/jvcr13pz.cgi?E+PZ+3+AOA0002+ERJ2RKF3301X+7+WW
  R43 R45 R47: Power (Watts): 1/10W; Case: 0402; Tolerance: ±1%
R48 = R_0402_15.0K: RES 15.0K OHM 1/10W 1% 0402 SMD; Manufacturer: Panasonic - ECG; Manufacturer Part Number: ERJ-2RKF1502X; Temperature Coefficient: ±100ppm/°C; Supplier 1: Digi-Key; Supplier Part Number 1: P15.0KLCT-ND; RoHS: RoHS Compliant; Category: Resistors; Stock 1: 695227; Pricing: 1=0.06, 50=0.0242, 100=0.0184, 250=0.01364, 500=0.01008, 1000=0.00672, 5000=0.00473 (USD); Resistance (Ohms): 15K; Composition: Thick Film; Features: -; Size / Dimension: 0.039" L x 0.020" W (1.00mm x 0.50mm); Height: 0.016" (0.40mm); Number of Terminations: 2; Packaging: Cut Tape (CT); Package / Case: 0402 (1005 Metric); ComponentLink1URL: http://industrial.panasonic.com/www-cgi/jvcr13pz.cgi?E+PZ+3+AOA0002+ERJ2RKF1502X+7+WW; ComponentLink1Description: http://industrial.panasonic.com/www-cgi/jvcr13pz.cgi?E+PZ+3+AOA0002+ERJ2RKF1502X+7+WW
R49 R51-R53 R55 R61 R65 R66 R71 R72 = R_0402_1.0M: RES 1.00M OHM 1/16W 1% 0402 SMD; Manufacturer: Yageo; Manufacturer Part Number: RC0402FR-071ML; Temperature Coefficient: ±100ppm/°C; Description: RES SMD 1M OHM 1% 1/16W 0402; Supplier 1: Digi-Key; RoHS: RoHS Compliant; Category: Resistors; Stock 1: 5123255; Composition: Thick Film; Features: Moisture Resistant; Packaging: Cut Tape (CT); ComponentLink1URL: http://www.yageo.com/documents/recent/PYu-RC_Group_51_RoHS_L_7.pdf; ComponentLink1Description: http://www.yageo.com/documents/recent/PYu-RC_Group_51_RoHS_L_7.pdf; Supplier Part Number 1: 311-1.00MLRCT-ND; Pricing 1: 1=0.1, 10=0.014, 100=0.0056, 1000=0.00253, 2500=0.0022, 5000=0.00181 (USD); Part Status: Active; Operating Temperature: -55°C ~ 155°C; Package / Case: 0402 (1005 Metric); Supplier Device Package: 0402; Size / Dimension: 0.039" L x 0.020" W (1.00mm x 0.50mm); Height - Seated (Max): 0.016" (0.40mm); Failure Rate: -
R50 R54 = R_0402_0.00: RES SMD 0.0OHM JUMPER 1/10W 0402; Manufacturer: Panasonic - ECG; Manufacturer Part Number: ERJ-2GE0R00X; Resistance (Ohms): 0.0; Power (Watts): 1/16W; Tolerance: ±1%; Supplier 1: Digi-Key; Supplier Part Number 1: P0.0JCT-ND; RoHS: RoHS Compliant; Category: Resistors; Stock 1: 9828264; Pricing: 1=0.05, 50=0.0172, 100=0.0131, 250=0.00976, 500=0.0072, 1000=0.0048, 5000=0.00338 (USD); Composition: Thick Film; Features: -; Temperature Coefficient: -; Package / Case: 0402 (1005 Metric); Size / Dimension: 0.039" L x 0.020" W (1.00mm x 0.50mm); Height: 0.016" (0.40mm); Number of Terminations: 2; Packaging: Cut Tape (CT); ComponentLink1URL: http://industrial.panasonic.com/www-cgi/jvcr13pz.cgi?E+PZ+3+AOA0001+ERJ2GE0R00X+7+WW; ComponentLink1Description: http://industrial.panasonic.com/www-cgi/jvcr13pz.cgi?E+PZ+3+AOA0001+ERJ2GE0R00X+7+WW
R56-R58 = R_0402_1.0K: RES 1.00K OHM 1/16W 1% 0402 SMD; Manufacturer: Yageo; Manufacturer Part Number: RC0402FR-071KL; Resistance (Ohms): 1K; Temperature Coefficient: ±100ppm/°C; Supplier 1: Digi-Key; Supplier Part Number 1: 311-1.00KLRCT-ND; RoHS: RoHS Compliant; Category: Resistors; Stock 1: 2103351; Pricing: 10=0.014, 100=0.0063, 500=0.00382, 1000=0.0027, 5000=0.00203 (USD); Composition: Thick Film; Features: -; Package / Case: 0402 (1005 Metric); Size / Dimension: 0.039" L x 0.020" W (1.00mm x 0.50mm); Height: 0.016" (0.40mm); Number of Terminations: 2; Packaging: Cut Tape (CT); ComponentLink1URL: http://www.yageo.com/documents/recent/PYu-RC0402_51_RoHS_L_6.pdf; ComponentLink1Description: http://www.yageo.com/documents/recent/PYu-RC0402_51_RoHS_L_6.pdf
R60 = R_0402_100K: RES SMD 100K OHM 1% 1/16W 0402; Manufacturer: Yageo; Manufacturer Part Number: RC0402FR-07100KL; Temperature Coefficient: ±100ppm/°C; Supplier 1: Digi-Key; RoHS: RoHS Compliant; Category: Resistors; Stock 1: 4989982; Pricing 1: 1=0.1, 10=0.013, 25=0.0096, 100=0.0054, 250=0.00412, 500=0.00328, 1000=0.00242, 2500=0.0021, 5000=0.00173 (USD); Packaging: Cut Tape (CT); Resistance (Ohms): 100k; Composition: Thick Film; Features: Moisture Resistant; Operating Temperature: -55°C ~ 155°C; Package / Case: 0402 (1005 Metric); Supplier Device Package: 0402; Size / Dimension: 0.039" L x 0.020" W (1.00mm x 0.50mm); Height: 0.016" (0.40mm); Number of Terminations: 2; ComponentLink1URL: http://www.yageo.com/NewPortal/yageodocoutput?fileName=/pdf/R-Chip/PYu-RC_Group_51_RoHS_L_3.pdf; ComponentLink1Description: http://www.yageo.com/NewPortal/yageodocoutput?fileName=/pdf/R-Chip/PYu-RC_Group_51_RoHS_L_3.pdf; Supplier Part Number 1: 311-100KLRCT-ND
R62-R64 R67 R70 R73 R221 R222 = R_0402_10.0K: RES 10.0K OHM 1/16W 1% 0402 SMD; Manufacturer: Stackpole Electronics Inc; Manufacturer Part Number: RMCF0402FT10K0; Resistance (Ohms): 10k; Temperature Coefficient: ±100ppm/°C; Supplier 1: Digi-Key; Supplier Part Number 1: RMCF0402FT10K0CT-ND; RoHS: RoHS Compliant; Category: Resistors; Stock 1: 234525; Pricing: 1=0.04, 10=0.025, 50=0.0138, 100=0.0105, 250=0.0078, 500=0.00576, 1000=0.00384, 2500=0.00324, 5000=0.0027 (USD); Composition: Thick Film; Features: -; Package / Case: 0402 (1005 Metric); Size / Dimension: 0.039" L x 0.020" W (1.00mm x 0.50mm); Height: 0.016" (0.40mm); Number of Terminations: 2; Packaging: Cut Tape (CT); ComponentLink1URL: http://www.seielect.com/Catalog/SEI-RMCF_RMCP.pdf; ComponentLink1Description: http://www.seielect.com/Catalog/SEI-RMCF_RMCP.pdf
R223 = R_0402_2.2K: RES SMD 2.2K OHM 1% 1/10W 0402; Manufacturer: Panasonic Electronic Components; Manufacturer Part Number: ERJ-2RKF2201X; Temperature Coefficient: ±100ppm/°C; Supplier 1: Digi-Key; RoHS: RoHS Compliant; Category: Resistors; Stock 1: 1256647; Pricing 1: 1=0.1, 50=0.015, 100=0.011, 250=0.0084, 500=0.00674, 1000=0.00496, 5000=0.00355 (USD); Packaging: Cut Tape (CT); Resistance (Ohms): 2.2k; Composition: Thick Film; Features: Automotive AEC-Q200; Operating Temperature: -55°C ~ 155°C; Package / Case: 0402 (1005 Metric); Supplier Device Package: 0402; Size / Dimension: 0.039" L x 0.020" W (1.00mm x 0.50mm); Height: 0.016" (0.40mm); Number of Terminations: 2; ComponentLink1URL: http://industrial.panasonic.com/www-cgi/jvcr13pz.cgi?E+PZ+3+AOA0002+ERJ2RKF2201X+7+WW; ComponentLink1Description: http://industrial.panasonic.com/www-cgi/jvcr13pz.cgi?E+PZ+3+AOA0002+ERJ2RKF2201X+7+WW; Supplier Part Number 1: P2.20KLCT-ND
R224 R226 = R_0402_49.9: RES 49.9 OHM 1/16W 1% 0402 SMD; Manufacturer: Stackpole Electronics Inc; Manufacturer Part Number: RMCF0402FT49R9; Temperature Coefficient: ±200ppm/°C; Supplier 1: Digi-Key; Supplier Part Number 1: RMCF0402FT49R9DKR-ND; RoHS: RoHS Compliant; Category: Resistors; Stock 1: 717348; Pricing: 1=0.04, 10=0.025, 50=0.0138, 100=0.0105, 250=0.0078, 500=0.00576, 1000=0.00384 (USD); Composition: Thick Film; Features: -; Size / Dimension: 0.039" L x 0.020" W (1.00mm x 0.50mm); Height: 0.014" (0.35mm); Lead Style: Surface Mount (SMD - SMT); Packaging: Digi-Reel®; ComponentLink1URL: http://www.seielect.com/Catalog/SEI-RMC.pdf; ComponentLink1Description: http://www.seielect.com/Catalog/SEI-RMC.pdf
R225 = R_0402_1.5K: RES 1.50K OHM 1/10W 1% 0402 SMD; Manufacturer: Panasonic - ECG; Manufacturer Part Number: ERJ-2RKF1501X; Temperature Coefficient: ±100ppm/°C; Supplier 1: Digi-Key; Supplier Part Number 1: P1.50KLCT-ND; RoHS: RoHS Compliant; Category: Resistors; Stock 1: 1109737; Pricing: 1=0.06, 50=0.0242, 100=0.0184, 250=0.01364, 500=0.01008, 1000=0.00672, 5000=0.00473 (USD); Resistance (Ohms): 1.5K; Composition: Thick Film; Features: -; Size / Dimension: 0.039" L x 0.020" W (1.00mm x 0.50mm); Height: 0.016" (0.40mm); Number of Terminations: 2; Packaging: Cut Tape (CT); Package / Case: 0402 (1005 Metric); ComponentLink1URL: http://industrial.panasonic.com/www-cgi/jvcr13pz.cgi?E+PZ+3+AOA0002+ERJ2RKF1501X+7+WW; ComponentLink1Description: http://industrial.panasonic.com/www-cgi/jvcr13pz.cgi?E+PZ+3+AOA0002+ERJ2RKF1501X+7+WW
U2 = U_HD3SS460RHRR: IC MUX/DEMUX 4CH TYPE C2 28WQFN; PIN_COUNT: 29; Min Supply Voltage: 3V; Max Supply Voltage: 3.6V; Data Rate: 5.4Gbps; Number of Ports: 4; Bandwidth: 5.4GHz; Application_BuildNumber: *; PartNumber: HD3SS460RHRR; Alternate PartNumber: HD3SS460RHRT; PackageReference: RHR0028A; MountType: SMT; CompType: IC; RoHS: Y; Supplier 1: Digikey; Stock 1: 503; Pricing 1: 1=3.11, 10=2.792, 100=2.2877 (USD); Mount: Surface Mount; Number of Pins: 28; Min Operating Temperature: 0°C; Max Operating Temperature: 70°C; Product Type: Passive; REACH SVHC: No SVHC; Lead Free: Lead Free; ComponentLink1URL: http://www.ti.com/general/docs/lit/getliterature.tsp?genericPartNumber=HD3SS460&&fileType=pdf; ComponentLink1Description: http://www.ti.com/general/docs/lit/getliterature.tsp?genericPartNumber=HD3SS460&&fileType=pdf; Supplier Part Number 1: 296-42085-6-ND
U3 = U_W25Q80DVSNIG: 3V, 8Mbit, Serial Flash Memory with Dual and Qual SPI, SOIC-8; Description: IC FLASH 8MBIT 104MHZ 8SOIC; Memory Type: Non-Volatile; Write Cycle Time - Word, Page: 3ms; ComponentLink1Description: https://www.winbond.com/resource-files/w25q80dv_revg_07212015.pdf; ComponentLink1URL: https://www.winbond.com/resource-files/w25q80dv_revg_07212015.pdf; RoHS: RoHS Compliant; Supplier 1: Digi-Key; Supplier Part Number 1: W25Q80DVSNIG CT-ND; Category: Integrated Circuits (ICs); Stock 1: 106661; Pricing 1: 1=0.53 (USD); Packaging: Cut Tape (CT); Part Status: Active; Memory Format: FLASH; Technology: FLASH - NOR; Access Time: -; Memory Interface: SPI; Operating Temperature: -40°C ~ 85°C (TA); Mounting Type: Surface Mount; Package / Case: 8-SOIC (0.154", 3.90mm Width)
U4 = U_TPS65981ABQWRWERQ1: USB, Type-C Controller PMIC 56-QFN (8x8); Supplier 1: Digikey; Stock 1: 0; Pricing 1: 2000=3.0577 (USD); Number of Pins: 56; Lead Free: Lead Free; Supplier Part Number 1: TPS65981ABIRTQR-ND